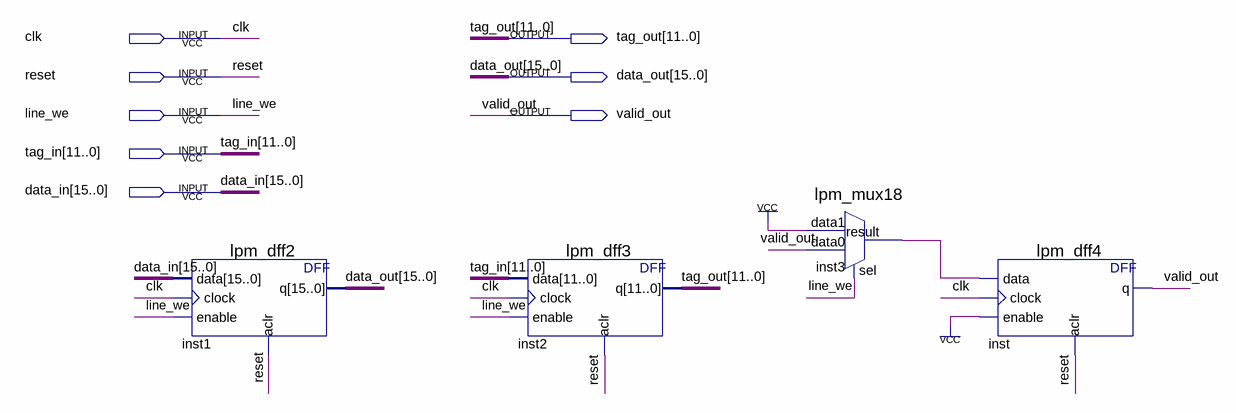
[diagram p0: schematic sheet]
// Quartus schematic cache_line.bdf as structural Verilog: 4 symbols, 8 pins
module cache_line (
  input  clk,
  input  reset,
  input  line_we,
  input  [11:0] tag_in,
  input  [15:0] data_in,
  output [11:0] tag_out,
  output [15:0] data_out,
  output valid_out
);

  wire inst3_result;

  lpm_dff2 inst1 (.data(data_in), .clock(clk), .enable(line_we), .aclr(reset), .q(data_out));
  lpm_dff3 inst2 (.data(tag_in), .clock(clk), .enable(line_we), .aclr(reset), .q(tag_out));
  lpm_mux18 inst3 (.data1(1'b1), .data0(valid_out), .sel(line_we), .result(inst3_result));
  lpm_dff4 inst (.data(inst3_result), .clock(clk), .enable(1'b1), .aclr(reset), .q(valid_out));
endmodule
